# Altium schematic sheet Rp2040.SchDoc
size A4; SheetNumber: 2; SheetTotal: 6
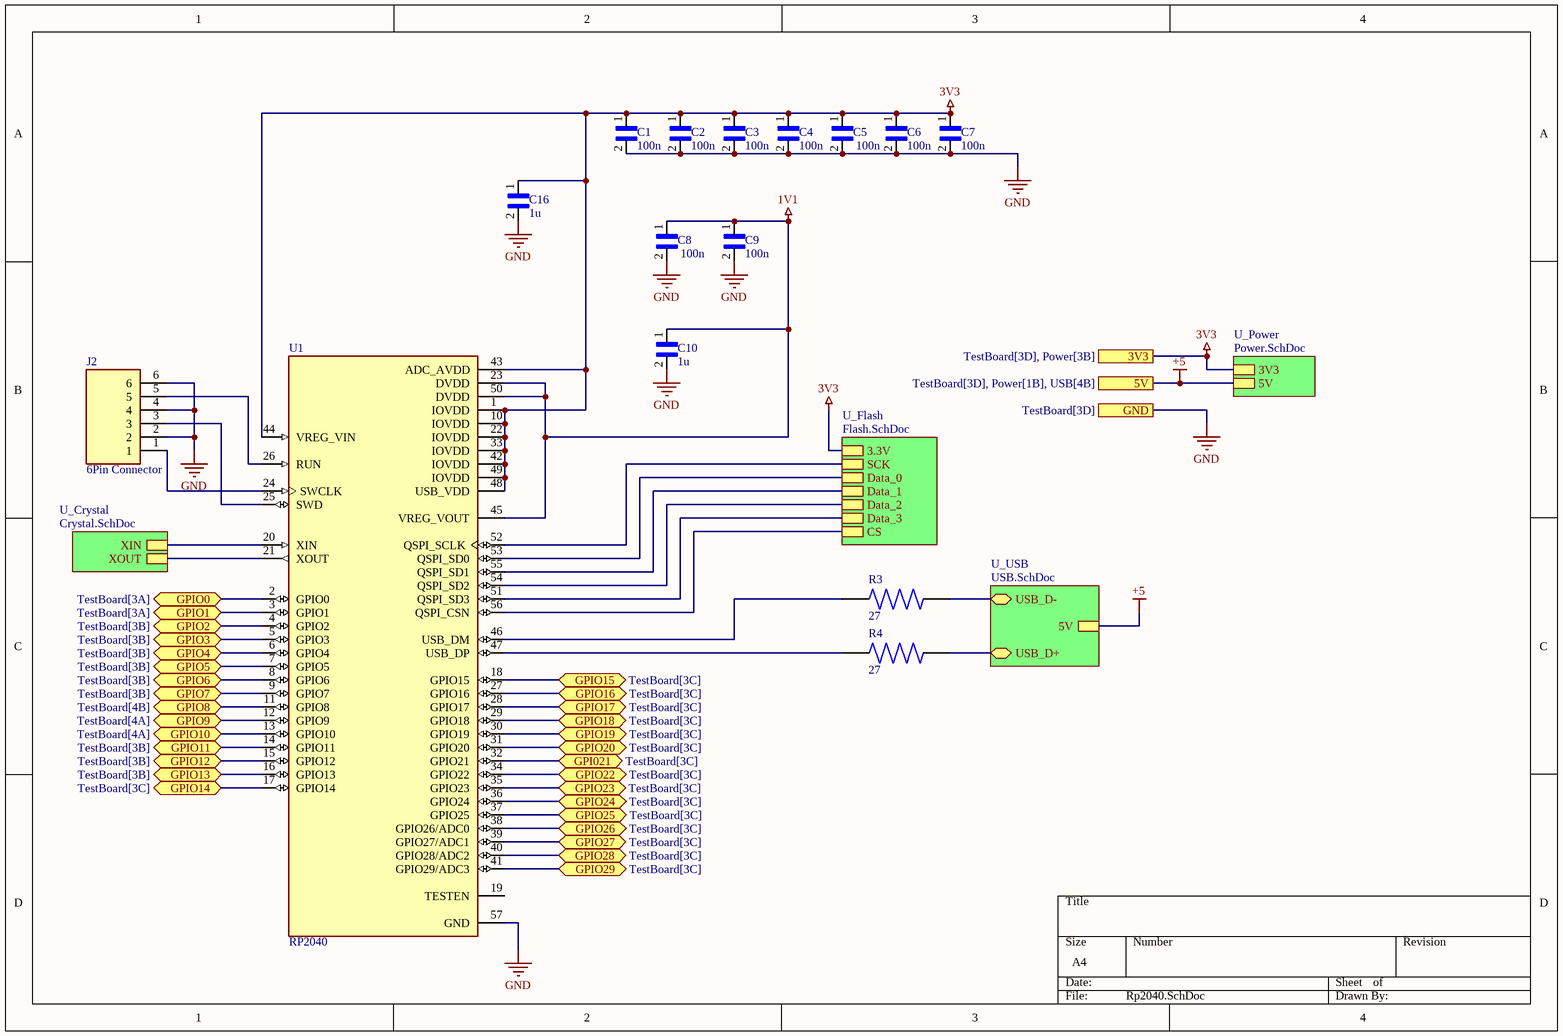
[diagram p0: Rp2040.SchDoc]

## Parts
C1  100n  [SMD Capacator]
C2  100n  [SMD Capacator]
C3  100n  [SMD Capacator]
C4  100n  [SMD Capacator]
C5  100n  [SMD Capacator]
C6  100n  [SMD Capacator]
C7  100n  [SMD Capacator]
C8  100n  [SMD Capacator]
C9  100n  [SMD Capacator]
C10  1u  [SMD Capacator]
C16  1u  [SMD Capacator]
J2  6Pin Connector  [6Pin Connector]
R3  27  [SMD Resistor]
R4  27  [SMD Resistor]
U1  RP2040  [RP2040]

## Sub-sheets
U_Crystal = Crystal.SchDoc: XIN, XOUT
U_Flash = Flash.SchDoc: 3.3V, SCK, Data_0, Data_1, Data_2, Data_3, CS
U_Power = Power.SchDoc: 5V, 3V3
U_USB = USB.SchDoc: 5V, USB_D+ (bidir), USB_D- (bidir)

## Ports
3V3 (see TestBoard[3D], Power[3B]), 5V (see TestBoard[3D], Power[1B], USB[4B]), GND (see TestBoard[3D]), GPI021 (bidir, see TestBoard[3C]), GPIO0 (bidir, see TestBoard[3A]), GPIO1 (bidir, see TestBoard[3A]), GPIO2 (bidir, see TestBoard[3B]), GPIO3 (bidir, see TestBoard[3B]), GPIO4 (bidir, see TestBoard[3B]), GPIO5 (bidir, see TestBoard[3B]), GPIO6 (bidir, see TestBoard[3B]), GPIO7 (bidir, see TestBoard[3B]), GPIO8 (bidir, see TestBoard[4B]), GPIO9 (bidir, see TestBoard[4A]), GPIO10 (bidir, see TestBoard[4A]), GPIO11 (bidir, see TestBoard[3B]), GPIO12 (bidir, see TestBoard[3B]), GPIO13 (bidir, see TestBoard[3B]), GPIO14 (bidir, see TestBoard[3C]), GPIO15 (bidir, see TestBoard[3C]), GPIO16 (bidir, see TestBoard[3C]), GPIO17 (bidir, see TestBoard[3C]), GPIO18 (bidir, see TestBoard[3C]), GPIO19 (bidir, see TestBoard[3C]), GPIO20 (bidir, see TestBoard[3C]), GPIO22 (bidir, see TestBoard[3C]), GPIO23 (bidir, see TestBoard[3C]), GPIO24 (bidir, see TestBoard[3C]), GPIO25 (bidir, see TestBoard[3C]), GPIO26 (bidir, see TestBoard[3C]), GPIO27 (bidir, see TestBoard[3C]), GPIO28 (bidir, see TestBoard[3C]), GPIO29 (bidir, see TestBoard[3C])

## Nets
1V1: C8.1 C9.1 C10.1 U1.23(DVDD) U1.45(VREG_VOUT) U1.50(DVDD)
3V3: C1.1 C2.1 C3.1 C4.1 C5.1 C6.1 C7.1 C16.1 U1.1(IOVDD) U1.10(IOVDD) U1.22(IOVDD) U1.33(IOVDD) U1.42(IOVDD) U1.43(ADC_AVDD) U1.44(VREG_VIN) U1.48(USB_VDD) U1.49(IOVDD) ; port 3V3, sheet U_Flash/3.3V, sheet U_Power/3V3
+5: port 5V, sheet U_USB/5V, sheet U_Power/5V
GND: C1.2 C2.2 C3.2 C4.2 C5.2 C6.2 C7.2 C8.2 C9.2 C10.2 C16.2 J2.2 J2.4 J2.6 U1.57(GND) ; port GND
GPI021: U1.32(GPIO21) ; port GPI021
GPIO0: U1.2(GPIO0) ; port GPIO0
GPIO1: U1.3(GPIO1) ; port GPIO1
GPIO2: U1.4(GPIO2) ; port GPIO2
GPIO3: U1.5(GPIO3) ; port GPIO3
GPIO4: U1.6(GPIO4) ; port GPIO4
GPIO5: U1.7(GPIO5) ; port GPIO5
GPIO6: U1.8(GPIO6) ; port GPIO6
GPIO7: U1.9(GPIO7) ; port GPIO7
GPIO8: U1.11(GPIO8) ; port GPIO8
GPIO9: U1.12(GPIO9) ; port GPIO9
GPIO10: U1.13(GPIO10) ; port GPIO10
GPIO11: U1.14(GPIO11) ; port GPIO11
GPIO12: U1.15(GPIO12) ; port GPIO12
GPIO13: U1.16(GPIO13) ; port GPIO13
GPIO14: U1.17(GPIO14) ; port GPIO14
GPIO15: U1.18(GPIO15) ; port GPIO15
GPIO16: U1.27(GPIO16) ; port GPIO16
GPIO17: U1.28(GPIO17) ; port GPIO17
GPIO18: U1.29(GPIO18) ; port GPIO18
GPIO19: U1.30(GPIO19) ; port GPIO19
GPIO20: U1.31(GPIO20) ; port GPIO20
GPIO22: U1.34(GPIO22) ; port GPIO22
GPIO23: U1.35(GPIO23) ; port GPIO23
GPIO24: U1.36(GPIO24) ; port GPIO24
GPIO25: U1.37(GPIO25) ; port GPIO25
GPIO26: U1.38(GPIO26/ADC0) ; port GPIO26
GPIO27: U1.39(GPIO27/ADC1) ; port GPIO27
GPIO28: U1.40(GPIO28/ADC2) ; port GPIO28
GPIO29: U1.41(GPIO29/ADC3) ; port GPIO29
NetJ2_1: J2.1 U1.24(SWCLK)
NetJ2_3: J2.3 U1.25(SWD)
NetJ2_5: J2.5 U1.26(RUN)
NetR3_1: R3.1 U1.46(USB_DM)
NetR3_2: R3.2 ; sheet U_USB/USB_D-
NetR4_1: R4.1 U1.47(USB_DP)
NetR4_2: R4.2 ; sheet U_USB/USB_D+
NetU1_20: U1.20(XIN) ; sheet U_Crystal/XIN
NetU1_21: U1.21(XOUT) ; sheet U_Crystal/XOUT
NetU1_51: U1.51(QSPI_SD3) ; sheet U_Flash/Data_3
NetU1_52: U1.52(QSPI_SCLK) ; sheet U_Flash/SCK
NetU1_53: U1.53(QSPI_SD0) ; sheet U_Flash/Data_0
NetU1_54: U1.54(QSPI_SD2) ; sheet U_Flash/Data_2
NetU1_55: U1.55(QSPI_SD1) ; sheet U_Flash/Data_1
NetU1_56: U1.56(QSPI_CSN) ; sheet U_Flash/CS

Not connected (* = marked no-connect by the designer): U1 19(TESTEN)

## Library data of the parts
C1-C10 C16 = SMD Capacator
R3 R4 = SMD Resistor